# EAGLE design BLEduino_Test_Board (EAGLE 6.2)
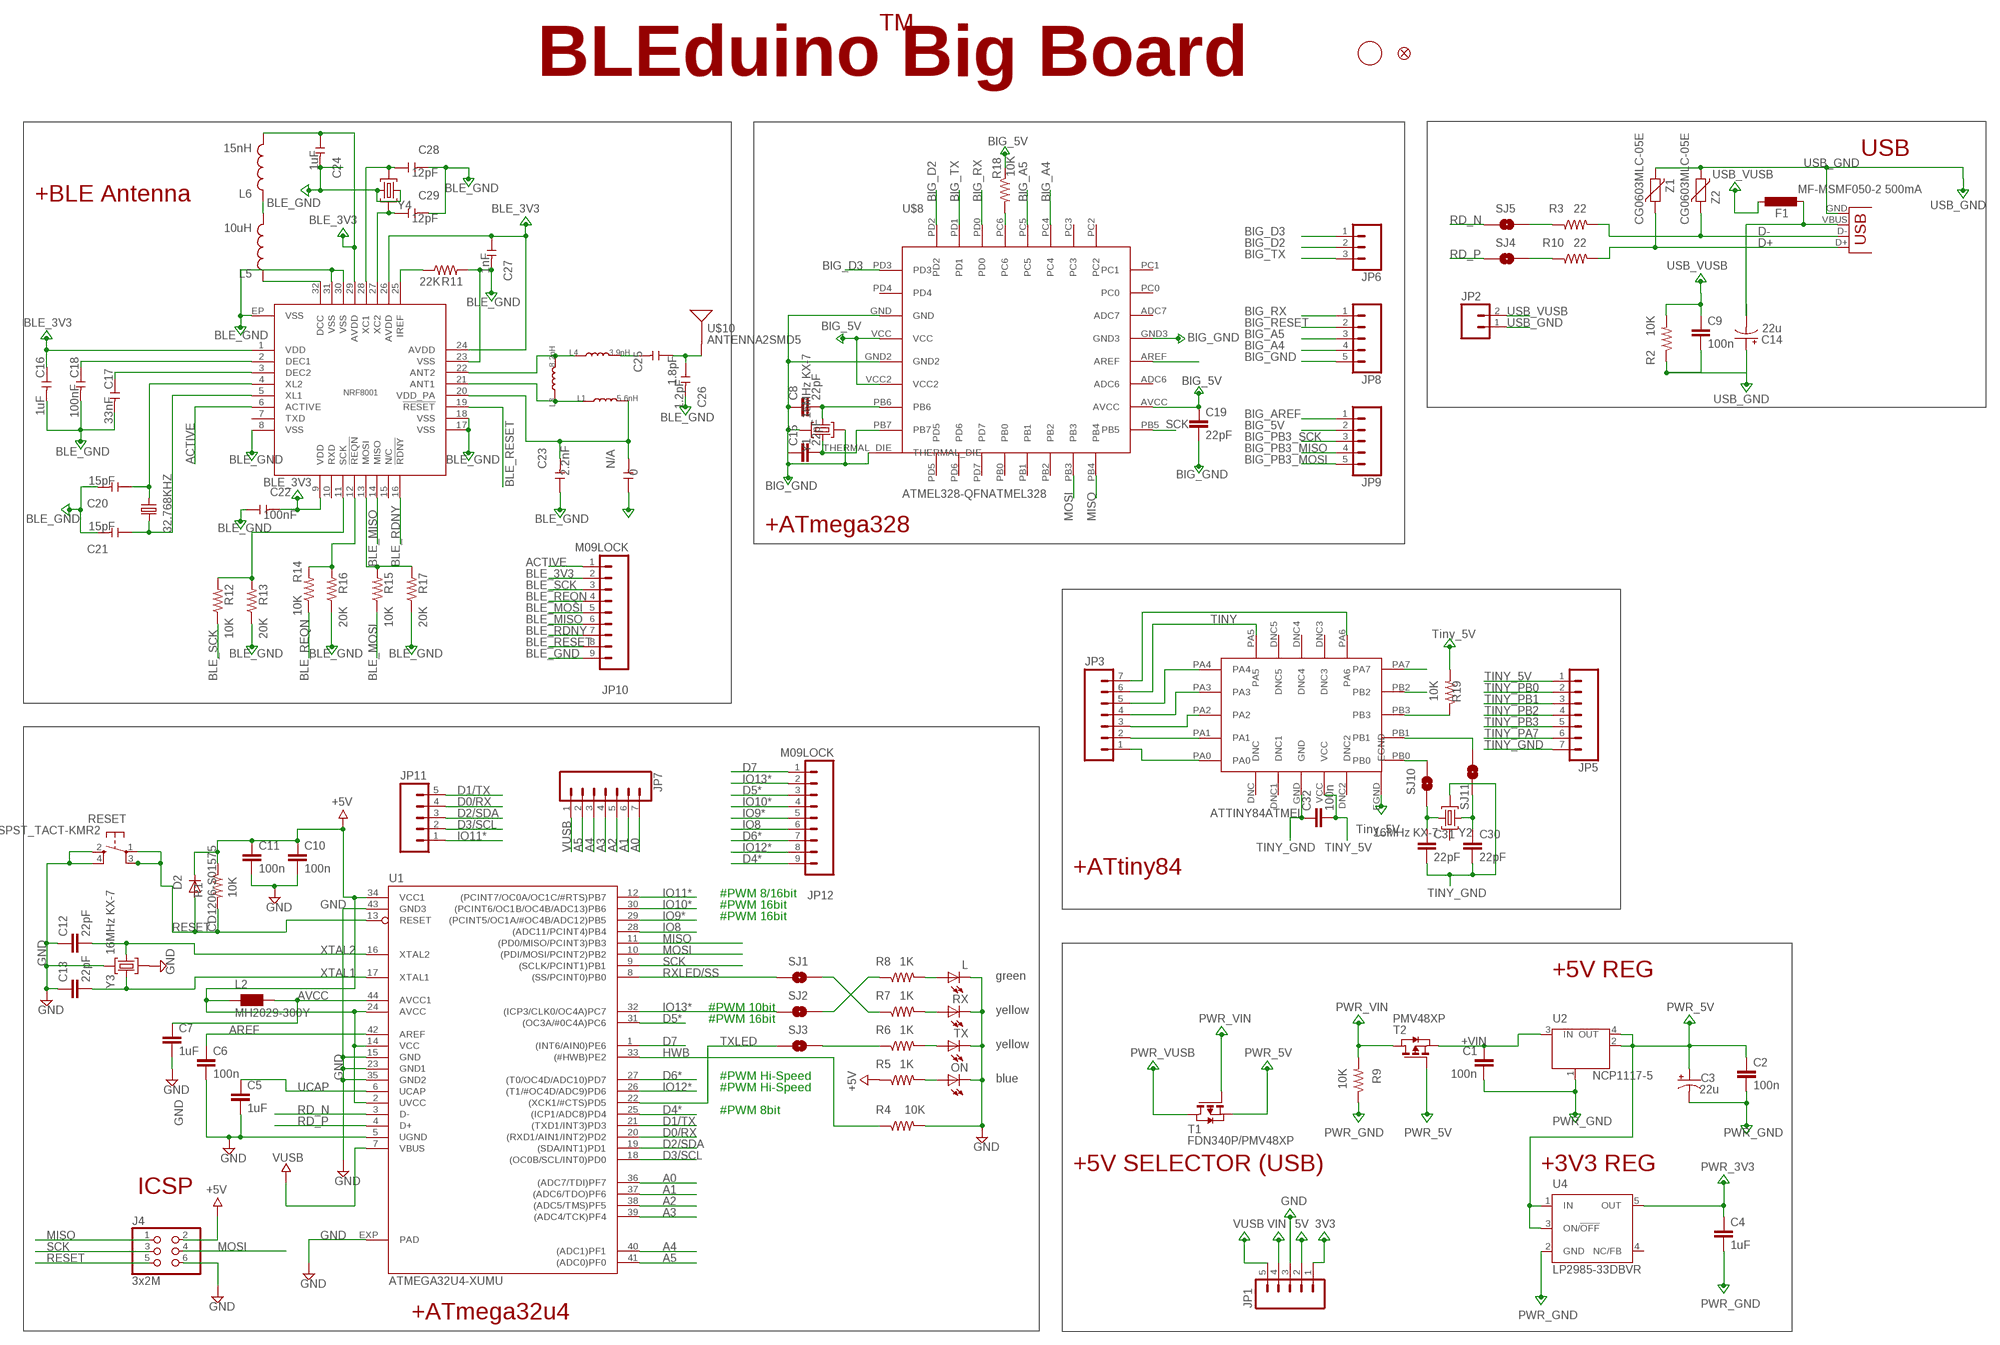
[diagram p0: schematic, sheet 1]

## Parts
32.768KHZ  FITNESSDEVICE_CRYSTAL-ABS10  [FITNESSDEVICE_CRYSTAL-ABS10]
C1  100n  CAP0603-CAP  [0603-CAP]
C2  100n  CAP0603-CAP  [0603-CAP]
C3  22u  CAP_POL1206  [EIA3216]
C4  1uF  CAP0603-CAP  [0603-CAP]
C5  1uF  CAP0603-CAP  [0603-CAP]
C6  100n  CAP0603-CAP  [0603-CAP]
C7  1uF  CAP0603-CAP  [0603-CAP]
C8  22pF  CAP0603-CAP  [0603-CAP]
C9  100n  CAP0603-CAP  [0603-CAP]
C10  100n  CAP0603-CAP  [0603-CAP]
C11  100n  CAP0603-CAP  [0603-CAP]
C12  22pF  CAP0603-CAP  [0603-CAP]
C13  22pF  CAP0603-CAP  [0603-CAP]
C14  22u  CAP_POL1206  [EIA3216]
C15  22pF  CAP0603-CAP  [0603-CAP]
C16  1uF  C-0603  [C0603]
C17  33nF  C-0402  [C0402]
C18  100nF  C-0402  [C0402]
C19  22pF  CAP0603-CAP  [0603-CAP]
C20  15pF  C-0402  [C0402]
C21  15pF  C-0402  [C0402]
C22  100nF  C-0402  [C0402]
C23  2.2nF  C-0402  [C0402]
C24  1uF  C-0603  [C0603]
C25  1.8pF  C-0402  [C0402]
C26  1.2pF  C-0402  [C0402]
C27  1nF  C-0402  [C0402]
C28  12pF  C-0402  [C0402]
C29  12pF  C-0402  [C0402]
C30  22pF  CAP0603-CAP  [0603-CAP]
C31  22pF  CAP0603-CAP  [0603-CAP]
C32  100n  CAP0603-CAP  [0603-CAP]
D2  CD1206-S01575  DIODE-MINIMELF  [MINIMELF]
F1  MF-MSMF050-2 500mA  L-EUL1812  [L1812]
J4  3x2M  PINHD-2X3  [2X03]
JP1  M05LOCK  [1X05_LOCK]
JP2  M02LOCK  [1X02_LOCK]
JP3  M07LOCK  [1X07_LOCK]
JP5  M07LOCK  [1X07_LOCK]
JP6  M03LOCK  [1X03_LOCK]
JP7  M07LOCK  [1X07_LOCK]
JP8  M05LOCK  [1X05_LOCK]
JP9  M05LOCK  [1X05_LOCK]
JP10  M09LOCK  [1X09_LOCK]
JP11  M05LOCK  [1X05_LOCK]
JP12  M09LOCK  [1X09_LOCK]
L  green  LEDCHIPLED_0805  [CHIPLED_0805]
L1  5.6nH  L'0402'  [L0402]
L2  MH2029-300Y  WE-CBF_0805  [0805]
L3  8.2nH  L'0402'  [L0402]
L4  3.9nH  L'0402'  [L0402]
L5  10uH  INDUCTOR0402  [C0402@1]
L6  15nH  INDUCTOR0402  [C0402@1]
N/A  0  C-0402  [C0402]
NRF8001  FITNESSDEVICE_NRF8001  [FITNESSDEVICE_QFN-32]
ON  blue  LEDCHIPLED_0805  [CHIPLED_0805]
R1  10K  RESISTOR0603-RES  [0603-RES]
R2  10K  RESISTOR0603-RES  [0603-RES]
R3  22  RESISTOR0603-RES  [0603-RES]
R4  10K  RESISTOR0603-RES  [0603-RES]
R5  1K  RESISTOR0603-RES  [0603-RES]
R6  1K  RESISTOR0603-RES  [0603-RES]
R7  1K  RESISTOR0603-RES  [0603-RES]
R8  1K  RESISTOR0603-RES  [0603-RES]
R9  10K  RESISTOR0603-RES  [0603-RES]
R10  22  RESISTOR0603-RES  [0603-RES]
R11  22K  RESISTOR0402-RES  [0402-RES]
R12  10K  RESISTOR0402-RES  [0402-RES]
R13  20K  RESISTOR0402-RES  [0402-RES]
R14  10K  RESISTOR0402-RES  [0402-RES]
R15  10K  RESISTOR0402-RES  [0402-RES]
R16  20K  RESISTOR0402-RES  [0402-RES]
R17  20K  RESISTOR0402-RES  [0402-RES]
R18  10K  RESISTOR0603-RES  [0603-RES]
R19  10K  RESISTOR0603-RES  [0603-RES]
RESET  SPST_TACT-KMR2  [KMR2]
RX  yellow  LEDCHIPLED_0805  [CHIPLED_0805]
SJ1  SOLDERJUMPERNO  [SJ_2S-NO]
SJ2  SOLDERJUMPERNO  [SJ_2S-NO]
SJ3  SOLDERJUMPERNO  [SJ_2S-NO]
SJ4  SOLDERJUMPERNO  [SJ_2S-NO]
SJ5  SOLDERJUMPERNO  [SJ_2S-NO]
SJ10  SOLDERJUMPERNO  [SJ_2S-NO]
SJ11  SOLDERJUMPERNO  [SJ_2S-NO]
T1  FDN340P/PMV48XP  PMOSSOT23  [SOT-23]
T2  PMV48XP  PMOSSOT23  [SOT-23]
TINY  ATTINY84ATMEL  [ATTINT84-QFN]
TX  yellow  LEDCHIPLED_0805  [CHIPLED_0805]
U1  ATMEGA32U4-XUMU  [QFN44ML7X7]
U2  NCP1117-5  LINEAR_MC33269ST  [LINEAR_SOT223]
U4  LP2985-33DBVR  LP2985-XXDBVR33  [SOT23-DBV]
U$8  ATMEL328-QFNATMEL328  [QFN]
U$10  ANTENNA2SMD5  [ANTENNA-CHIP5]
U$37  FIDUCIALMOUNT  [FIDUCIA-MOUNT]
U$53  FIDUCIAL1X2  [FIDUCIAL-1X2]
X1  USB-MICROB  [USB-MICROB]
Y1  16MHz KX-7  CRYSTAL-3.2-2.5  [CRYSTAL-3.2-2.5]
Y2  16MHz KX-7  CRYSTAL-3.2-2.5  [CRYSTAL-3.2-2.5]
Y3  16MHz KX-7  CRYSTAL-3.2-2.5  [CRYSTAL-3.2-2.5]
Y4  16MHz KX-7  CRYSTAL-3.2-2.5  [CRYSTAL-3.2-2.5]
Z1  CG0603MLC-05E  VARISTORCN0603  [CT/CN0603]
Z2  CG0603MLC-05E  VARISTORCN0603  [CT/CN0603]

## Nets
+5V: C10.1 C11.1 D2.C J4.2 L2.1 R1.1 R5.1 U1.2(UVCC) U1.14(VCC) U1.24(AVCC) U1.34(VCC1)
+VIN: C1.1 T2.2(S) U2.3(IN)
A0: JP7.7 U1.36((ADC7/TDI)PF7)
A1: JP7.6 U1.37((ADC6/TDO)PF6)
A2: JP7.5 U1.38((ADC5/TMS)PF5)
A3: JP7.4 U1.39((ADC4/TCK)PF4)
A4: JP7.3 U1.40((ADC1)PF1)
A5: JP7.2 U1.41((ADC0)PF0)
ACTIVE: JP10.1 NRF8001.6(ACTIVE)
AREF: C6.1 U1.42(AREF)
AVCC: C7.1 L2.2 U1.44(AVCC1)
BIG_5V: C19.1 JP9.2 R18.1 U$8.AVCC U$8.VCC U$8.VCC2
BIG_A4: JP8.4 U$8.PC4
BIG_A5: JP8.3 U$8.PC5
BIG_AREF: JP9.1 U$8.AREF
BIG_D2: JP6.2 U$8.PD2
BIG_D3: JP6.1 U$8.PD3
BIG_GND: C8.1 C15.1 C19.2 JP8.5 U$8.GND U$8.GND2 U$8.GND3 U$8.THERMAL_DIE Y1.2(GND) Y1.4(GND)
BIG_PB3_MISO: JP9.4 U$8.PB4
BIG_PB3_MOSI: JP9.5 U$8.PB3
BIG_PB3_SCK: JP9.3 U$8.PB5
BIG_RESET: JP8.2 R18.2 U$8.PC6
BIG_RX: JP8.1 U$8.PD0
BIG_TX: JP6.3 U$8.PD1
BLE_3V3: C16.1 C22.2 C24.1 C27.1 JP10.2 L6.2 NRF8001.1(VDD) NRF8001.9(VDD) NRF8001.24(AVDD) NRF8001.26(AVDD) NRF8001.29(AVDD)
BLE_GND: C16.2 C17.2 C18.2 C20.2 C21.2 C22.1 C23.1 C24.2 C26.2 C27.2 C28.2 C29.2 JP10.9 N/A.1 NRF8001.8(VSS) NRF8001.17(VSS) NRF8001.18(VSS) NRF8001.23(VSS) NRF8001.30(VSS) NRF8001.31(VSS) NRF8001.EP(VSS) R11.2 R13.1 R16.1 R17.1 Y4.1(C1) Y4.3(C2)
BLE_MISO: JP10.6 NRF8001.14(MISO)
BLE_MOSI: JP10.5 R15.1
BLE_MOSI_SHIFTED: NRF8001.13(MOSI) R15.2 R17.2
BLE_RDNY: JP10.7 NRF8001.16(!RDNY)
BLE_REQN: JP10.4 R14.1
BLE_REQN_SHIFTED: NRF8001.12(!REQN) R14.2 R16.2
BLE_RESET: JP10.8 NRF8001.19(!RESET)
BLE_SCK: JP10.3 R12.1
BLE_SCK_SHIFTED: NRF8001.11(SCK) R12.2 R13.2
D0/RX: JP11.4 U1.20((RXD1/AIN1/INT2)PD2)
D1/TX: JP11.5 U1.21((TXD1/INT3)PD3)
D2/SDA: JP11.3 U1.19((SDA/INT1)PD1)
D3/SCL: JP11.2 U1.18((OC0B/SCL/INT0)PD0)
D4*: JP12.9 U1.25((ICP1/ADC8)PD4)
D5*: JP12.3 U1.31((OC3A/#0C4A)PC6)
D6*: JP12.7 U1.27((T0/OC4D/ADC10)PD7)
D7: JP12.1 U1.1((INT6/AIN0)PE6)
D+: R10.2 X1.D+ Z1.1
D-: R3.2 X1.D- Z2.1
GND: C5.2 C6.2 C7.2 C10.2 C11.2 C12.1 C13.1 J4.6 L.C ON.C R4.2 RESET.2(S) RESET.4(S1) RX.C TX.C U1.5(UGND) U1.15(GND) U1.23(GND1) U1.35(GND2) U1.43(GND3) U1.EXP(PAD) Y3.2(GND) Y3.4(GND)
HWB: R4.1 U1.33((#HWB)PE2)
IO8: JP12.6 U1.28((ADC11/PCINT4)PB4)
IO9*: JP12.5 U1.29((PCINT5/OC1A/#OC4B/ADC12)PB5)
IO10*: JP12.4 U1.30((PCINT6/OC1B/OC4B/ADC13)PB6)
IO11*: JP11.1 U1.12((PCINT7/OC0A/OC1C/#RTS)PB7)
IO12*: JP12.8 U1.26((T1/#OC4D/ADC9)PD6)
IO13*: JP12.2 SJ2.1 U1.32((ICP3/CLK0/OC4A)PC7)
MISO: J4.1 U1.11((PD0/MISO/PCINT3)PB3)
MOSI: J4.4 U1.10((PDI/MOSI/PCINT2)PB2)
N$1: R7.1 SJ1.2
N$2: R7.2 RX.A
N$3: ON.A R5.2
N$4: R6.2 TX.A
N$5: R8.1 SJ2.2
N$6: R6.1 SJ3.2
N$7: L.A R8.2
N$8: R3.1 SJ5.2
N$9: R10.1 SJ4.2
N$10: C8.2 U$8.PB6 Y1.1(C1)
N$12: C15.2 U$8.PB7 Y1.3(C2)
N$13: C18.1 NRF8001.2(DEC1)
N$15: L5.1 NRF8001.32(DCC)
N$16: C30.1 SJ11.2 Y2.3(C2)
N$17: L5.2 L6.1
N$18: C17.1 NRF8001.3(DEC2)
N$19: 32.768KHZ.P$1 C20.1 NRF8001.4(XL2)
N$20: 32.768KHZ.P$2 C21.1 NRF8001.5(XL1)
N$23: C23.2 L1.2 N/A.2 NRF8001.20(VDD_PA)
N$24: L3.2 L4.1 NRF8001.22(ANT2)
N$25: L1.1 L3.1 NRF8001.21(ANT1)
N$26: C25.2 L4.2
N$27: C25.1 C26.1 U$10.FEED(SIGNAL)
N$28: NRF8001.25(IREF) R11.1
N$29: C28.1 NRF8001.28(XC1) Y4.4(GND)
N$30: C29.1 NRF8001.27(XC2) Y4.2(GND)
N$34: C31.1 SJ10.1 Y2.1(C1)
PWR_3V3: C4.1 JP1.1 U4.5(OUT)
PWR_5V: C2.1 C3.A(+) JP1.2 T1.2(S) T2.3(G) U2.2(OUT) U2.4(OUT) U4.1(IN) U4.3(ON/!OFF)
PWR_GND: C1.2 C2.2 C3.C(-) C4.2 JP1.3 R9.1 U2.1(GND/ADJ) U4.2(GND)
PWR_VIN: JP1.4 R9.2 T1.3(G) T2.1(D)
PWR_VUSB: JP1.5 T1.1(D)
RD_N: SJ5.1 U1.3(D-)
RD_P: SJ4.1 U1.4(D+)
RESET: D2.A J4.5 R1.2 RESET.1(P) RESET.3(P1) U1.13(RESET)
RXLED/SS: SJ1.1 U1.8((SS/PCINT0)PB0)
SCK: J4.3 U1.9((SCLK/PCINT1)PB1)
TINY_5V: C32.2 JP5.1 R19.2 TINY.VCC
TINY_GND: C30.2 C31.2 C32.1 JP5.7 TINY.EGND TINY.GND Y2.4(GND)
TINY_PA0: JP3.1 TINY.PA0
TINY_PA1: JP3.2 TINY.PA1
TINY_PA2: JP3.3 TINY.PA2
TINY_PA3: JP3.4 TINY.PA3
TINY_PA4: JP3.5 TINY.PA4
TINY_PA5: JP3.6 TINY.PA5
TINY_PA6: JP3.7 TINY.PA6
TINY_PA7: JP5.6 TINY.PA7
TINY_PB0: JP5.2 SJ10.2 TINY.PB0
TINY_PB1: JP5.3 SJ11.1 TINY.PB1
TINY_PB2: JP5.4 TINY.PB2
TINY_PB3: JP5.5 R19.1 TINY.PB3
TXLED: SJ3.1 U1.22((XCK1/#CTS)PD5)
UCAP: C5.1 U1.6(UCAP)
USB_GND: C9.2 C14.A(+) JP2.1 R2.1 X1.GND Z1.2 Z2.2
USB_VUSB: C9.1 F1.2 JP2.2 R2.2
VUSB: JP7.1 U1.7(VBUS)
VUSBD: C14.C(-) F1.1 X1.VBUS
XTAL1: C13.2 U1.17(XTAL1) Y3.3(C2)
XTAL2: C12.2 U1.16(XTAL2) Y3.1(C1)
Unconnected: NRF8001.7(TXD) NRF8001.10(RXD) NRF8001.15(N/C) TINY.DNC TINY.DNC1 TINY.DNC2 TINY.DNC3 TINY.DNC4 TINY.DNC5 U4.4(NC/FB) U$8.ADC6 U$8.ADC7 U$8.PB0 U$8.PB1 U$8.PB2 U$8.PC0 U$8.PC1 U$8.PC2 U$8.PC3 U$8.PD4 U$8.PD5 U$8.PD6 U$8.PD7 Y2.2(GND)

## Notes on the sheet
- TM
- BLEduino Big Board
- BIG_5V
- USB
- +BLE Antenna
- BIG_5V
- BIG_GND
- BIG_5V
- SCK
- BIG_GND
- BIG_GND
- MOSI | MISO
- +ATmega328
- Tiny_5V
- Tiny_5V
- +ATtiny84
- #PWM 8/16bit
- #PWM 16bit
- #PWM 16bit
- +5V REG
- #PWM 10bit
- #PWM 16bit
- #PWM Hi-Speed
- #PWM Hi-Speed
- #PWM 8bit
- +5V SELECTOR (USB) | +3V3 REG
- ICSP
- GND
- VUSB | VIN | 5V | 3V3
- +ATmega32u4

## Library data of the parts
32.768KHZ = bluetooth:FITNESSDEVICE_CRYSTAL-ABS10: ABS10-32.768KHZ-9-T
C1 C2 C4-C13 C15 C19 C30-C32 = SparkFun:CAP: Capacitor Standard 0603 ceramic capacitor, and 0.1" leaded capacitor.
C3 C14 = SparkFun:CAP_POL: Capacitor Polarized These are standard SMD and PTH capacitors. Normally 10uF, 47uF, and 100uF in electrolytic and tantalum varieties. Always verify the external diameter of the through hole cap, it varies with capacity, voltage, and manufacturer. The EIA devices should be standard.
C16-C18 C20-C29 N/A = Discrete:C*: Ceramic Capacitors
D2 = diode:DIODE-: DIODE
F1 = rcl:L-EU: INDUCTOR, European symbol
J4 = SmartPrj:PINHD-2X3: PIN HEADER
JP1 JP8 JP9 JP11 = SparkFun:M05: Header 5 Standard 5-pin 0.1" header. Use with straight break away headers (SKU : PRT-00116), right angle break away headers (PRT-00553), swiss pins (PRT-00743), machine pins (PRT-00117), and female headers (PRT-00115). Molex polarized connector foot print use with SKU : PRT-08230 with associated crimp pins and housings.
JP2 = SparkFun:M02: Header 2 Standard 2-pin 0.1" header. Use with straight break away headers (SKU : PRT-00116), right angle break away headers (PRT-00553), swiss pins (PRT-00743), machine pins (PRT-00117), and female headers (PRT-00115). Molex polarized connector foot print use with SKU : PRT-08233 with associated crimp pins and housings.
JP3 JP5 JP7 = SparkFun:M07: Header 7 Standard 7-pin 0.1" header. Use with straight break away headers (SKU : PRT-00116), right angle break away headers (PRT-00553), swiss pins (PRT-00743), machine pins (PRT-00117), and female headers (PRT-00115). NOTES ON THE VARIANTS LOCK and LOCK_LONGPADS... This footprint was designed to help hold the alignment of a through-hole component (i.e. 7-pin header) while soldering it into place. You may notice that each hole has been shifted either up or down by 0.005 of an inch from it's more standard position (which is usually a perfectly straight line). This slight alteration caused the pins (the squares in the middle) to touch the edges of the holes. Because they are alternating, it causes a "brace" to hold the header in place. 0.005 has proven to be the perfect amount of "off-center" position when using our standard breakaway headers. Although looks a little odd when you look at the bare footprint, once you have a header in there, the alteration is very hard to notice. Also, if you push a header all the way into place, it is covered up entirely on the bottom side. This idea of altering the position of holes to aid alignment will be further integrated into the Sparkfun Library for other footprints. It can help hold any component with 3 or more connection pins.
JP6 = SparkFun:M03: Header 3 Standard 3-pin 0.1" header. Use with straight break away headers (SKU : PRT-00116), right angle break away headers (PRT-00553), swiss pins (PRT-00743), machine pins (PRT-00117), and female headers (PRT-00115). Molex polarized connector foot print use with SKU : PRT-08232 with associated crimp pins and housings.
JP10 JP12 = SparkFun:M09: Header 9 Standard 9-pin 0.1" header. Use with straight break away headers (SKU : PRT-00116), right angle break away headers (PRT-00553), swiss pins (PRT-00743), machine pins (PRT-00117), and female headers (PRT-00115).
L ON RX TX = led:LED: LED OSRAM: - CHIPLED LG R971, LG N971, LY N971, LG Q971, LY Q971, LO R971, LY R971 LH N974, LH R974 LS Q976, LO Q976, LY Q976 LO Q996 - Hyper CHIPLED LW Q18S LB Q993, LB Q99A, LB R99A - SideLED LS A670, LO A670, LY A670, LG A670, LP A670 LB A673, LV A673, LT A673, LW A673 LH A674 LY A675 LS A676, LA A676, LO A676, LY A676, LW A676 LS A679, LY A679, LG A679 - Hyper Micro SIDELED® LS Y876, LA Y876, LO Y876, LY Y876 LT Y87S - SmartLED LW L88C, LW L88S LB L89C, LB L89S, LG L890 LS L89K, LO L89K, LY L89K LS L896, LA L896, LO L896, LY L896 - TOPLED LS T670, LO T670, LY T670, LG T670, LP T670 LSG T670, LSP T670, LSY T670, LOP T670, LYG T670 LG T671, LOG T671, LSG T671 LB T673, LV T673, LT T673, LW T673 LH T674 LS T676, LA T676, LO T676, LY T676, LB T676, LH T676, LSB T676, LW T676 LB T67C, LV T67C, LT T67C, LS T67K, LO T67K, LY T67K, LW E67C LS E67B, LA E67B, LO E67B, LY E67B, LB E67C, LV E67C, LT E67C LW T67C LS T679, LY T679, LG T679 LS T770, LO T770, LY T770, LG T770, LP T770 LB T773, LV T773, LT T773, LW T773 LH T774 LS E675, LA E675, LY E675, LS T675 LS T776, LA T776, LO T776, LY T776, LB T776 LHGB T686 LT T68C, LB T68C - Hyper Mini TOPLED® LB M676 - Mini TOPLED Santana® LG M470 LS M47K, LO M47K, LY M47K Source: http://www.osram.convergy.de LUXEON: - LUMILED® LXK2-PW12-R00, LXK2-PW12-S00, LXK2-PW14-U00, LXK2-PW14-V00 LXK2-PM12-R00, LXK2-PM12-S00, LXK2-PM14-U00 LXK2-PE12-Q00, LXK2-PE12-R00, LXK2-PE12-S00, LXK2-PE14-T00, LXK2-PE14-U00 LXK2-PB12-K00, LXK2-PB12-L00, LXK2-PB12-M00, LXK2-PB14-N00, LXK2-PB14-P00, LXK2-PB14-Q00 LXK2-PR12-L00, LXK2-PR12-M00, LXK2-PR14-Q00, LXK2-PR14-R00 LXK2-PD12-Q00, LXK2-PD12-R00, LXK2-PD12-S00 LXK2-PH12-R00, LXK2-PH12-S00 LXK2-PL12-P00, LXK2-PL12-Q00, LXK2-PL12-R00 Source: www.luxeon.com KINGBRIGHT: KA-3528ASYC Source: www.kingbright.com
L1 L3 L4 = Discrete:L*
L2 = wuerth-elektronik:WE-CBF: SMD EMI Suppression Ferrite Beads - excellent anti-EMI properties - low DCR - impedances till 3000 ohms - rated current up to 6 A
L5 L6 = SparkFun:INDUCTOR: Inductors Basic Inductor/Choke - 0603 and 1206. Footprints are not proven and vary greatly between part numbers.
NRF8001 = bluetooth:FITNESSDEVICE_NRF8001: nRF8001 is a Bluetooth® low energy solution designed for operation in the peripheral role. By integrating a Bluetooth low energy compliant radio (PHY), slave mode link controller and host, nRF8001 offers you an easy way to add Bluetooth low energy connectivity to your application.
R1-R19 = SparkFun:RESISTOR: Resistor Basic schematic elements and footprints for 0603, 1206, and PTH resistors.
RESET = adafruit:SPST_TACT: SMT 6mm switch, EVQQ2 series http://www.ladyada.net/library/eagle
SJ1-SJ5 SJ10 SJ11 = SparkFun:SOLDERJUMPER: Solder Jumper Standard SMD solder jumper. Used to automate production. Two varients : Normally Open and Normally Closed are the same, but have different paste layers. NC will have a large amount of paste and should jumper during reflow.
T1 T2 = zetex:PMOSSOT23: MOS FET
TINY = Mark-ATTINY84:ATTINY84
U1 = SmartPrj:ATMEGA32U4-XU
U2 = SmartPrj:LINEAR_MC33269ST*: Adjustable Output Low Dropout Voltage Regulator 800 mA Source: http://www.onsemi.com/pub/Collateral/MC33269-D.PDF
U4 = SmartPrj:LP2985-XXDBVR: ULTRALOW-POWER 50-mA LOW-DROPOUT LINEAR REGULATORS 50-mA Low-Dropout Regulator Source: http://focus.ti.com/lit/ds/symlink/tps77001.pdf
U$8 = Mark-ATmega328-qft:ATMEL328-QFN
U$10 = SparkFun:ANTENNA2: Antenna Single endded antenna. Common with smaller chip antennas. CHIP4 package is the GPS Chip Antenna SKU: GPS-08418. CHIP5 package is 2.4GHz chip antenna SKU: WRL-00144.
U$37 = SmartPrj:FIDUCIALMOUNT
U$53 = SparkFun:FIDUCIAL: Fiducial Alignment Points Various fiducial points for machine vision alignment.
X1 = SparkFun:USB: USB Connectors USB-B-PTH is fully proven SKU : PRT-00139 USB-miniB is fully proven SKU : PRT-00587 USB-A-PCB is untested. USB-A-H is throughly reviewed, but untested. Spark Fun Electronics SKU : PRT-00437 USB-B-SMT is throughly reviewed, but untested. Needs silkscreen touching up. USB-A-S has not been used/tested USB-MB-H has not been used/tested
Y1-Y4 = SmartPrj:CRYSTAL-3.2-2.5
Z1 Z2 = varistor:VARISTOR: VARISTOR

## Net classes
0 default: width 0.203 mm

## Board
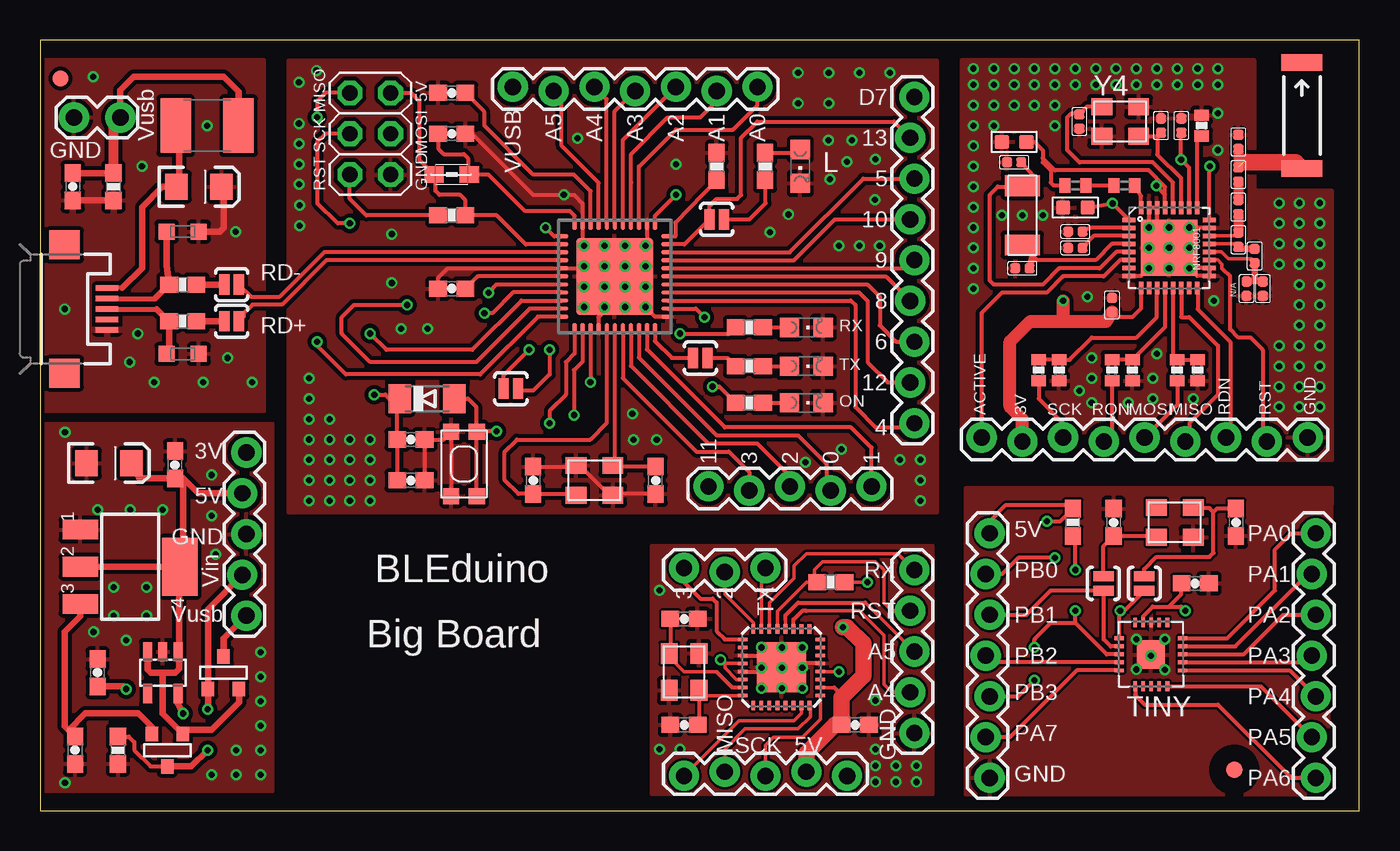
[diagram p1: board, top side]
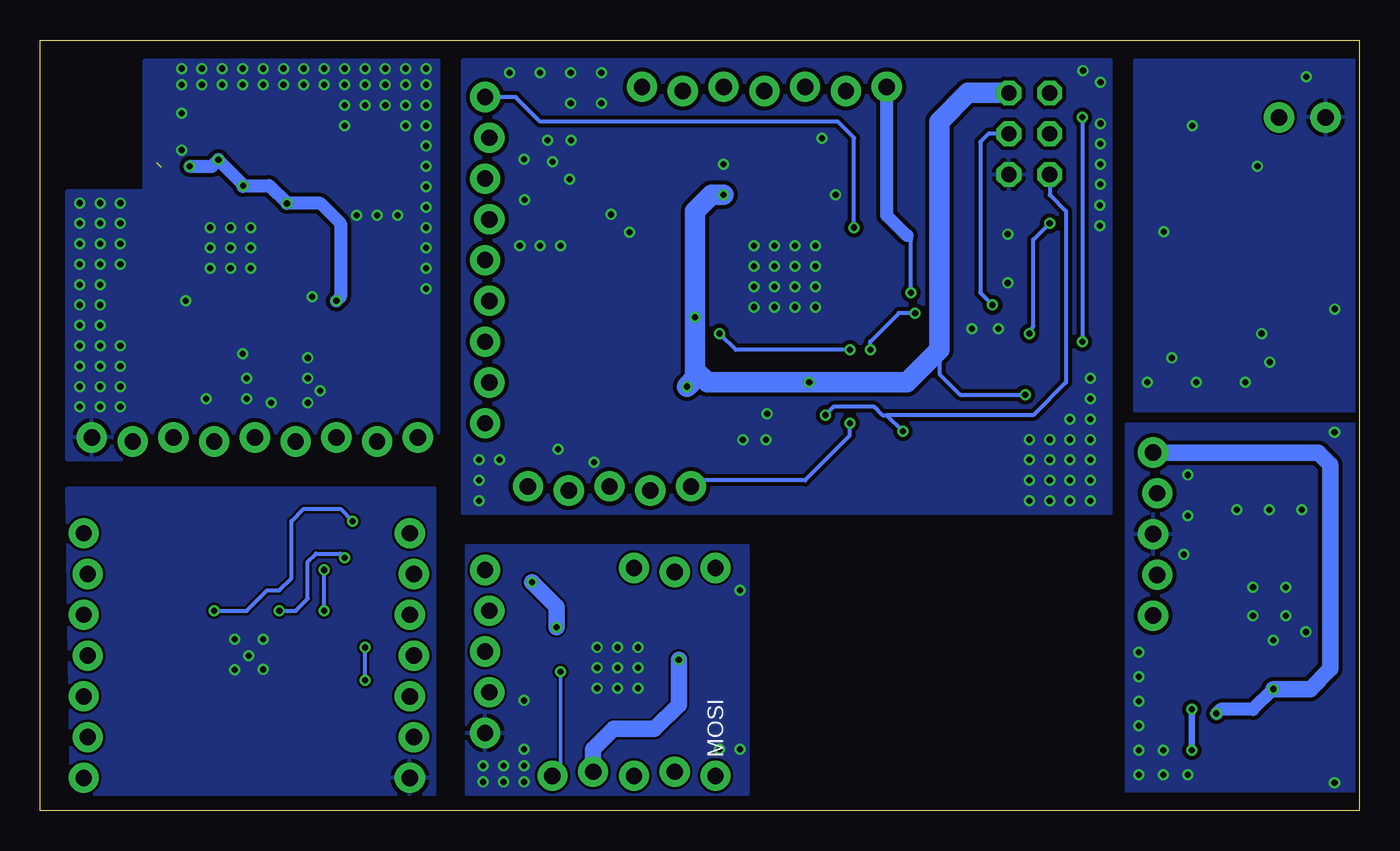
[diagram p2: board, bottom side, seen from below]

Size 82.22 x 48 mm. Coordinates in mm from the lower left corner, seen from the top.
Outline: 0,0 82.22,0 82.22,48 0,48 0,0
Copper layers (1*2*15*16): Top 0.035mm / dielectric 0.2mm / layer 2 0.0175mm / dielectric 1.1mm / layer 15 0.0175mm / dielectric 0.2mm / Bottom 0.035mm
Design rules: minimum track width 6mil, minimum drill 12mil, track to track 6mil, track to pad 6mil, pad to pad 6mil, via to via 6mil, smd to smd 0mil, copper to edge 10mil, drill to drill 10mil, minimum pad ring 6mil, minimum via ring 6mil, stop-mask expansion 2mil, vias tented up to drill 25mil, thermal gap 10mil

### Footprints (pad centres in the part's own frame; a part is rotated, then mirrored left to right if it is on the bottom)
FITNESSDEVICE_CRYSTAL-ABS10 = smd 1.3 x 2.2: P$1 -1.85,0; P$2 1.85,0
0603-CAP = smd 1.1 x 1: 1 -0.85,0; 2 0.85,0
EIA3216 = smd 1.4 x 1.6: A 1.4,0; C -1.4,0
C0603 = smd 0.889 x 0.889: 1 -0.762,0; 2 0.762,0
C0402 = smd 0.635 x 0.635: 1 -0.445,0; 2 0.445,0
MINIMELF = smd 1.4 x 1.8: A 1.7,0; C -1.7,0
L1812 = smd 1.9 x 3.4: 1 -1.95,0; 2 1.95,0
2X03 = drill 0.95 pad 1.55 octagon: 1 -2.54,-1.27; 2 -2.54,1.27; 3 0,-1.27; 4 0,1.27; 5 2.54,-1.27; 6 2.54,1.27
1X05_LOCK = drill 1.016 pad 1.88: 1 0,0.127; 2 2.54,-0.127; 3 5.08,0.127; 4 7.62,-0.127; 5 10.16,0.127
1X02_LOCK = drill 1.016 pad 1.88: 1 -0.178,0; 2 2.718,0
1X07_LOCK = drill 1.016 pad 1.88: 1 0,0.127; 2 2.54,-0.127; 3 5.08,0.127; 4 7.62,-0.127; 5 10.16,0.127; 6 12.7,-0.127; 7 15.24,0.127
1X03_LOCK = drill 1.016 pad 1.88: 1 0,0.127; 2 2.54,-0.127; 3 5.08,0.127
1X09_LOCK = drill 1.016 pad 1.88: 1 0,0.127; 2 2.54,-0.127; 3 5.08,0.127; 4 7.62,-0.127; 5 10.16,0.127; 6 12.7,-0.127; 7 15.24,0.127; 8 17.78,-0.127; 9 20.32,0.127
CHIPLED_0805 = smd 1.2 x 1.2: A 0,-1.05; C 0,1.05
L0402 = smd 0.635 x 0.635: 1 -0.445,0; 2 0.445,0
0805 = smd 1.2 x 1: 1 -1.1,0; 2 1.1,0
C0402' = smd 0.7 x 0.9: 1 -0.65,0; 2 0.65,0
FITNESSDEVICE_QFN-32 = smd 0.285 x 0.8: 1 -1.75,-2.5; 2 -1.25,-2.5; 3 -0.75,-2.5; 4 -0.25,-2.5; 5 0.25,-2.5; 6 0.75,-2.5; 7 1.25,-2.5; 8 1.75,-2.5; 17 1.75,2.5; 18 1.25,2.5; 19 0.75,2.5; 20 0.25,2.5; 21 -0.25,2.5; 22 -0.75,2.5; 23 -1.25,2.5; 24 -1.75,2.5 | smd 0.8 x 0.285: 9 2.5,-1.75; 10 2.5,-1.25; 11 2.5,-0.75; 12 2.5,-0.25; 13 2.5,0.25; 14 2.5,0.75; 15 2.5,1.25; 16 2.5,1.75; 25 -2.5,1.75; 26 -2.5,1.25; 27 -2.5,0.75; 28 -2.5,0.25; 29 -2.5,-0.25; 30 -2.5,-0.75; 31 -2.5,-1.25; 32 -2.5,-1.75 | smd 3.5 x 3.5: EP 0,0
0603-RES = smd 1.1 x 1: 1 -0.85,0; 2 0.85,0
0402-RES = smd 0.7 x 0.9: 1 -0.65,0; 2 0.65,0
KMR2 = smd 1 x 1: 1 2,0.8; 2 2,-0.8; 3 -2,0.8; 4 -2,-0.8
SJ_2S-NO = smd 0.635 x 1.27: 1 -0.45,0; 2 0.45,0
SOT-23 = smd 0.787 x 0.889: 1 0.025,-1.016; 2 -0.94,1.016; 3 0.991,1.016
ATTINT84-QFN = smd 0.23 x 0.6: DNC -1.03,-2.06; DNC1 -0.53,-2.06; DNC2 0.97,-2.06; DNC3 0.47,1.91; DNC4 -0.03,1.91; DNC5 -0.53,1.91; GND -0.03,-2.06; PA5 -1.03,1.91; PA6 0.97,1.91; VCC 0.47,-2.06 | smd 1.78 x 1.78: EGND -0.01,-0.06 | smd 0.6 x 0.23: PA0 -1.99,-1.08; PA1 -1.99,-0.58; PA2 -1.99,-0.08; PA3 -1.99,0.42; PA4 -1.99,0.92; PA7 1.96,0.92; PB0 1.96,-1.08; PB1 1.96,-0.58; PB2 1.96,0.42; PB3 1.96,-0.08
QFN44ML7X7 = smd 0.75 x 0.275: 1 -3.275,2.5; 2 -3.275,2; 3 -3.275,1.5; 4 -3.275,1; 5 -3.275,0.5; 6 -3.275,0; 7 -3.275,-0.5; 8 -3.275,-1; 9 -3.275,-1.5; 10 -3.275,-2; 11 -3.275,-2.5; 23 3.275,-2.5; 24 3.275,-2; 25 3.275,-1.5; 26 3.275,-1; 27 3.275,-0.5; 28 3.275,0; 29 3.275,0.5; 30 3.275,1; 31 3.275,1.5; 32 3.275,2; 33 3.275,2.5 | smd 0.275 x 0.75: 12 -2.5,-3.275; 13 -2,-3.275; 14 -1.5,-3.275; 15 -1,-3.275; 16 -0.5,-3.275; 17 0,-3.275; 18 0.5,-3.275; 19 1,-3.275; 20 1.5,-3.275; 21 2,-3.275; 22 2.5,-3.275; 34 2.5,3.275; 35 2,3.275; 36 1.5,3.275; 37 1,3.275; 38 0.5,3.275; 39 0,3.275; 40 -0.5,3.275; 41 -1,3.275; 42 -1.5,3.275; 43 -2,3.275; 44 -2.5,3.275 | smd 4.826 x 4.826: EXP 0,0
LINEAR_SOT223 = smd 1.219 x 2.235: 1 -2.311,-3.099; 2 0,-3.099; 3 2.311,-3.099 | smd 3.6 x 2.2: 4 0,3.099
SOT23-DBV = smd 0.55 x 1.2: 1 -0.95,-1.3; 2 0,-1.3; 3 0.95,-1.3; 4 0.95,1.3; 5 -0.95,1.3
QFN = smd 0.6 x 0.23: ADC6 2.4,-0.73; ADC7 2.4,0.77; AREF 2.4,-0.23; AVCC 2.4,-1.23; GND -2.45,0.77; GND2 -2.45,-0.23; GND3 2.4,0.27; PB5 2.4,-1.73; PB6 -2.45,-1.23; PB7 -2.45,-1.73; PC0 2.4,1.27; PC1 2.4,1.77; PD3 -2.45,1.77; PD4 -2.45,1.27; VCC -2.45,0.27; VCC2 -2.45,-0.73 | smd 0.23 x 0.6: PB0 -0.28,-2.34; PB1 0.22,-2.34; PB2 0.72,-2.34; PB3 1.22,-2.34; PB4 1.72,-2.34; PC2 1.72,2.43; PC3 1.22,2.43; PC4 0.72,2.43; PC5 0.22,2.43; PC6 -0.28,2.43; PD0 -0.78,2.43; PD1 -1.28,2.43; PD2 -1.78,2.43; PD5 -1.78,-2.34; PD6 -1.28,-2.34; PD7 -0.78,-2.34 | smd 3.1 x 3.1: THERMAL_DIE -0.03,0.04
ANTENNA-CHIP5 = smd 1.016 x 2.54: FEED -3.302,0; NC 3.302,0
FIDUCIA-MOUNT = smd 1.016 x 1.016: P$1 0,0
FIDUCIAL-1X2 = smd 1 x 1: 1 0,0
USB-MICROB = smd 0.35 x 1.4: D+ 0,2.65; D- -0.65,2.65; GND 1.3,2.65; ID 0.65,2.65; VBUS -1.3,2.65 | smd 1.8 x 1.9: MT1 -4,0; MT2 4,0
CRYSTAL-3.2-2.5 = smd 1.3 x 1.05: 1 -1.15,-0.925; 2 1.15,-0.925; 3 1.15,0.925; 4 -1.15,0.925
CT/CN0603 = smd 1 x 1: 1 -1,0; 2 1,0

### Placement (x,y rotation side)
32.768KHZ  61.21,37.08 90 top
C1  2.18,3.76 270 top
C2  8.41,21.54 90 top
C3  4.29,21.64 0 top
C4  3.58,8.59 90 top
C5  25.65,32.51 180 top
C6  25.65,44.7 180 top
C7  25.65,42.16 0 top
C8  40.13,11.94 180 top
C9  2.03,38.86 270 top
C10  23.11,20.57 0 top
C11  23.11,23.11 0 top
C12  30.73,20.57 270 top
C13  38.35,20.57 90 top
C14  9.91,38.86 0 top
C15  40.13,5.33 0 top
C16  64.52,37.57 180 top
C17  64.52,35.05 180 top
C18  64.52,36.07 180 top
C19  50.8,5.33 0 top
C20  61.21,33.78 180 top
C21  60.71,40.39 180 top
C22  66.8,31.5 270 top
C23  75.18,32.51 90 top
C24  60.71,41.66 180 top
C25  74.68,39.62 270 top
C26  74.68,41.66 90 top
C27  71.12,42.67 90 top
C28  64.77,42.93 270 top
C29  69.85,42.67 90 top
C30  66.9,17.96 90 top
C31  74.52,17.96 270 top
C32  71.98,14.15 180 top
D2  24.13,25.65 0 top
F1  10.41,42.67 0 top
J4  20.57,42.16 270 top
JP1  12.73,22.3 270 top
JP2  2.29,43.18 0 top
JP3  79.38,17.27 270 top
JP5  59.05,17.27 270 top
JP6  40.13,14.99 0 top
JP7  29.46,44.96 0 top
JP8  54.36,14.99 270 top
JP9  50.29,2.29 180 top
JP10  58.67,23.11 0 top
JP11  41.66,20.07 0 top
JP12  54.36,44.45 270 top
L  47.37,40.13 180 top
L1  75.69,34.54 270 top
L2  25.65,39.62 0 top
L3  74.68,35.56 90 top
L4  74.68,37.59 90 top
L5  10uH  [C0402']  67.56,38.94 180 top
L6  15nH  [C0402']  64.52,38.94 180 top
N/A  76.2,32.51 90 top
NRF8001  70.36,35.05 270 top
ON  47.75,25.4 270 top
R1  25.65,37.08 180 top
R2  4.57,38.86 90 top
R3  8.89,32.77 180 top
R4  42.16,40.13 90 top
R5  44.2,25.4 0 top
R6  44.2,27.69 0 top
R7  44.2,30.1 0 top
R8  45.19,40.13 90 top
R9  4.85,3.76 90 top
R10  8.89,30.48 180 top
R11  72.39,42.67 90 top
R12  62.23,27.43 90 top
R13  63.5,27.43 90 top
R14  66.8,27.43 90 top
R15  70.87,27.43 90 top
R16  68.07,27.43 90 top
R17  72.14,27.43 90 top
R18  49.28,14.22 180 top
R19  64.36,17.96 90 top
RESET  26.42,21.59 270 top
RX  47.75,30.1 270 top
SJ1  29.34,26.29 0 top
SJ2  42.16,36.83 0 top
SJ3  41.15,28.19 0 top
SJ4  11.94,30.48 180 top
SJ5  11.94,32.77 180 top
SJ10  68.81,14.15 270 top
SJ11  66.27,14.15 90 top
T1  11.46,8.59 180 top
T2  7.9,3.76 0 top
TINY  69.22,9.65 180 top
TX  47.75,27.69 270 top
U1  35.81,33.27 0 top
U2  5.61,15.19 270 top
U4  7.65,8.59 180 top
U$8  46.23,8.89 0 top
U$10  78.64,43.31 90 top
U$37  74.42,2.54 0 top
U$53  1.27,45.59 0 top
X1  1.52,31.24 270 top
Y1  40.13,8.64 270 top
Y2  70.71,17.96 180 top
Y3  34.54,20.57 0 top
Y4  67.31,42.93 0 top
Z1  8.89,28.45 0 top
Z2  8.89,36.07 0 top

### Tracks (layer width: path | path; a pad name or v marks a point on that pad's centre or on a via)
+5V  (via drill 0.38)
  Top 0.254: U1.14 34.31,26.69 v34.29,26.67 | U1.2 30.26,35.27 28.45,37.08 R1.1 26.5,38.01 26.16,38.35 24.89,38.35 24.64,38.61 24.64,39.54 L2.1 | L2.1 24.55,39.45 | C10.1 C11.1 22.26,25.15 | 22.26,25.15 22.26,25.49 D2.C | J4.2 23.11,44.7 23.62,44.2 23.62,40.56 L2.1 | U1.24 40.86,31.27 v41.4,30.73 | v41.91,26.42 42.33,26.42 R5.1 | U1.34 38.31,37.04 v39.62,38.35 | v20.83,25.91 21.5,25.91 22.26,25.15
  Bottom 0.254: 26.16,28.7 26.16,27.18 24.89,25.91 v20.83,25.91
  Bottom 1.27: 41.4,27.43 v41.4,30.73 41.4,37.34 40.39,38.35 v39.62,38.35 | 41.4,27.43 41.4,26.92 v41.91,26.42 | 41.4,27.43 40.64,26.67 v34.29,26.67 28.19,26.67 26.16,28.7 26.16,42.93 24.38,44.7 J4.2
+VIN
  Top 0.406: U2.3 2.52,12.09 1.55,11.12 1.55,5.24 1.78,5.01 | 2.48,4.61 C1.1 1.78,5.01 | T2.2 6.96,5.21 6.12,6.04 2.82,6.04 1.78,5.01
A0
  Top 0.254: U1.36 37.31,40.11 39.62,42.42 43.18,42.42 44.7,43.94 JP7.7
A1
  Top 0.254: U1.37 36.81,39.1 36.83,39.12 36.83,40.89 39.12,43.18 41.15,43.18 42.16,44.2 JP7.6
A2
  Top 0.254: U1.38 36.31,39.62 36.32,39.62 36.32,41.78 JP7.5
A3
  Top 0.254: U1.39 35.81,43.56 JP7.4
A4
  Top 0.254: U1.40 35.31,44.31 JP7.3
A5
  Top 0.254: U1.41 34.81,39.1 32.51,41.4 32.51,44.32 JP7.2
ACTIVE
  Top 0.254: NRF8001.6 67.32,34.3 66.29,33.27 63.75,33.27 62.74,32.26 59.94,32.26 58.67,30.99 JP10.1
AREF
  Top 0.254: U1.42 34.31,38.58 33.27,39.62 30.73,39.62 27.69,42.67 27.69,43.52 C6.1
AVCC
  Top 0.254: U1.44 33.31,37.04 33.02,37.34 30.23,37.34 27.94,39.62 L2.2 26.67,39.71 26.67,40.64 26.42,40.89 25.15,40.89 24.8,41.24 C7.1
BIG_5V  (via drill 0.38)
  Top 0.203: U$8.VCC2 43.4,8.16 42.67,8.89 42.67,9.14 v42.42,9.4 42.66,9.16 U$8.VCC
  Top 0.229: U$8.AVCC 49.49,7.66 | 50.04,5.42 C19.1 49.53,5.33 | v51.56,14.22 R18.1
  Top 0.254: 49.49,7.66 50.04,7.11
  Top 1.016: 49.53,5.33 47.75,3.56 JP9.2 | v50.04,11.43 50.29,11.43 51.31,10.41 51.31,8.38 50.04,7.11 49.95,7.02 C19.1
  Bottom 1.016: v51.56,14.22 50.04,12.7 v50.04,11.43 | 47.75,2.29 JP9.2 47.75,3.81 46.48,5.08 43.94,5.08 42.42,6.6 v42.42,9.4
BIG_A4
  Top 0.229: U$8.PC4 46.95,11.64 | 47.75,12.45 51.05,12.45 52.58,10.92 52.58,7.87 53.09,7.37 JP8.4
  Top 0.254: 47.75,12.45 47.5,12.45 46.95,11.9 U$8.PC4
BIG_A5
  Top 0.229: U$8.PC5 46.45,11.9 | 51.44,12.95 JP8.3
  Top 0.254: 46.45,11.9 46.45,12.16 47.24,12.95 51.44,12.95
BIG_AREF  (via drill 0.38)
  Top 0.203: U$8.AREF 49.76,8.66 v49.78,8.64
  Bottom 0.203: v49.78,8.64 49.78,2.67 JP9.1
BIG_D2
  Top 0.229: U$8.PD2 44.45,11.69 42.67,13.46 JP6.2
BIG_D3
  Top 0.254: JP6.1 40.13,14.22 41.15,13.21 41.91,13.21 42.16,12.95 42.16,11.18 42.67,10.67 U$8.PD3
BIG_GND  (via drill 0.38)
  Top 0.254: U$8.GND3 47.77,9.16 v47.5,8.89 | U$8.GND2 44.73,8.66 v44.96,8.89 | U$8.GND 45.21,9.65 | 43.69,9.65 U$8.GND | U$8.GND
  other vias: 44.96,10.16 46.23,10.16 47.5,10.16 46.23,8.89 44.96,7.62 46.23,7.62 47.5,7.62 39.88,3.81 38.61,3.81 52.07,3.81 52.07,2.79 52.07,1.78 53.34,1.78 53.34,2.79 54.61,2.79 54.61,1.78 52.07,6.86 38.61,13.72
  pour Top: 38.1,16.51 55.63,16.51 55.63,1.02 38.1,1.02
  pour Bottom: 38.1,16.51 55.63,16.51 55.63,1.02 38.1,1.02
BIG_PB3_MISO
  Top 0.229: JP9.4 42.67,3.81 43.94,5.08 47.24,5.08 48.01,5.84 48.01,6.49 U$8.PB4
BIG_PB3_MOSI
  Top 0.229: U$8.PB3 47.45,6.05 46.99,5.59 43.56,5.59 JP9.5
BIG_PB3_SCK
  Top 0.229: U$8.PB5 48.63,5.7 47.5,4.57 45.72,4.57 45.21,4.06 JP9.3
BIG_RESET
  Top 0.229: U$8.PC6 45.95,12.42 47.75,14.22 R18.2 48.26,14.39 48.26,14.99 48.77,15.49 52.07,15.49 52.58,14.99 52.58,12.95 53.09,12.45 JP8.2
BIG_RX
  Top 0.229: U$8.PD0 45.45,12.94 46.99,14.48 46.99,15.24 47.75,16 53.47,16 JP8.1
BIG_TX
  Top 0.229: U$8.PD1 44.95,14.85
  Top 0.254: 44.95,14.85 JP6.3
BLE_3V3  (via drill 0.38)
  Top 0.254: C16.1 v66.84,37.82 NRF8001.1 | NRF8001.9 68.61,31.27 68.07,30.73 66.91,30.73 C22.2 | L6.2 63.17,38.94 62.99,39.12 62.99,39.88 62.48,40.39 62.48,40.64 | NRF8001.26 71.61,40.05 v71.11,40.55 71.11,42.26 C27.1 | v69.57,38.91 70.11,38.38 NRF8001.29 70.11,38.86 69.09,39.88 63.25,39.88 62.48,40.64 | NRF8001.24 72.86,40.09 v72.9,40.13 | C24.1 61.98,41.66 62.48,41.15 62.48,40.64
  Top 0.813: JP10.2 61.21,24.38 60.45,25.15 60.45,29.21 61.72,30.48 63.75,30.48 | 63.75,30.48 66.44,30.48 C22.2 | v63.75,31.75 63.75,30.48
  Bottom 0.254: v71.11,40.55 71.12,40.56 | v69.57,38.91 69.57,38.89 69.6,38.86
  Bottom 0.813: v72.9,40.13 71.53,40.13 71.12,40.54 | 71.12,40.54 v71.11,40.55 | 69.6,38.86 69.6,38.94 | 69.6,38.94 69.6,39.01 71.12,40.54 | 69.6,38.94 67.96,38.94 v66.84,37.82 64.75,37.82 63.5,36.58 63.5,32 v63.75,31.75
BLE_GND  (via drill 0.38)
  Top 0.254: NRF8001.17 72.11,33.3 v71.63,33.78 NRF8001.EP | NRF8001.EP 71.61,33.8 NRF8001.18 72.86,33.31 72.9,33.27 | NRF8001.23 71.61,36.3 NRF8001.EP | NRF8001.30 NRF8001.31 | NRF8001.30 69.61,35.8 NRF8001.EP | NRF8001.30 69.13,37.55 69.09,37.59 v69.09,36.32 NRF8001.EP | NRF8001.8 68.61,33.3 v69.09,33.78 NRF8001.EP
  other vias: 79.76,25.15 78.49,25.15 77.22,25.15 77.22,26.42 78.49,26.42 79.76,26.42 79.76,27.69 78.49,27.69 77.22,27.69 77.22,28.96 78.49,28.96 79.76,28.96 79.76,30.23 78.49,30.23 78.49,31.5 79.76,31.5 79.76,32.77 78.49,32.77 78.49,34.04 79.76,34.04 79.76,35.31 78.49,35.31 77.22,35.31 77.22,34.04 73.15,31.75 71.88,25.65 69.34,25.65 67.82,25.4 69.34,26.92 69.6,28.45 65.53,28.19 65.53,26.92 64.77,26.16 65.53,25.4 65.28,32 62.48,37.08 61.21,37.08 59.94,37.08 73.41,41.15 73.41,43.43 73.41,45.21 73.41,46.23 72.14,46.23 72.14,45.21 70.87,45.21 70.87,46.23 69.6,45.21 69.6,46.23 68.33,46.23 68.33,45.21 67.06,45.21 67.06,46.23 65.79,46.23 65.79,45.21 64.52,45.21 64.52,46.23 63.25,46.23 63.25,45.21 63.25,43.94 63.25,42.67 61.98,43.94 61.98,45.21 61.98,46.23 60.71,46.23 60.71,45.21 60.71,43.94 59.44,43.94 59.44,45.21 59.44,46.23 58.17,46.23 58.17,45.21 58.17,43.94 58.17,42.67 59.44,42.67 58.17,41.4 58.17,40.13 58.17,38.86 58.17,37.59 58.17,36.32 58.17,35.05 58.17,33.78 58.17,32.51 70.36,35.05 69.09,35.05 70.36,36.32 71.63,36.32 71.63,35.05 70.36,33.78 77.22,36.58 77.22,37.85 78.49,37.85 78.49,36.58 79.76,36.58 79.76,37.85
  pour Bottom (isolate 0.254): 80.52,21.84 80.52,38.61 75.69,38.61 75.69,46.74 57.4,46.74 57.4,21.84
  pour Top (isolate 0.254): 80.52,21.84 80.52,38.61 75.69,38.61 75.69,46.74 57.4,46.74 57.4,21.84
BLE_MISO
  Top 0.254: NRF8001.14 71.11,30.75 71.62,30.75 73.41,28.96 73.41,25.91 71.63,24.13 71.63,23.24 JP10.6
BLE_MOSI
  Top 0.254: R15.1 70.87,25.27 JP10.5
BLE_MOSI_SHIFTED
  Top 0.254: NRF8001.13 70.61,28.34 R15.2 R17.2
BLE_RDNY
  Top 0.254: NRF8001.16 72.14,32.52 72.14,31.24 74.17,29.21 74.17,23.5 JP10.7
BLE_REQN
  Top 0.254: R14.1 66.8,23.5 JP10.4
BLE_REQN_SHIFTED
  Top 0.254: NRF8001.12 70.11,30.12 R16.2 R14.2
BLE_RESET
  Top 0.203: NRF8001.19 73.39,34.3 73.66,34.04 73.66,33.78
  Top 0.254: JP10.8 76.2,23.24 76.2,28.7 75.44,29.46 74.68,29.46 74.17,29.97 74.17,33.27 73.66,33.78
BLE_SCK
  Top 0.254: R12.1 62.23,25.65 63.75,24.13 JP10.3
BLE_SCK_SHIFTED
  Top 0.254: R12.2 R13.2 64.15,28.08 65.53,29.46 68.33,29.46 69.6,30.73 69.6,32.54 NRF8001.11
D0/RX
  Top 0.254: U1.20 37.31,28.22 42.16,23.37 47.24,23.37 49.02,21.59 49.02,20.19 JP11.4
D1/TX
  Top 0.254: U1.21 37.81,28.73 42.67,23.88 50.55,23.88 51.82,22.61 JP11.5
D2/SDA
  Top 0.254: U1.19 36.81,27.7 41.66,22.86 44.7,22.86 46.74,20.83 JP11.3
D3/SCL
  Top 0.254: U1.18 36.31,26.93 40.89,22.35 42.93,22.35 44.2,21.08 JP11.2
D4*
  Top 0.254: U1.25 50.52,31.77 50.8,31.5 50.8,25.15 52.07,23.88 54.23,23.88 JP12.9
D5*
  Top 0.254: U1.31 46.71,34.77 51.31,39.37 JP12.3
D6*
  Top 0.254: U1.27 51.55,32.77 52.32,32 52.32,30.23 53.34,29.21 JP12.7
D7  (via drill 0.38)
  Top 0.254: U1.1 32.04,35.77 v31.5,36.32
  Bottom 0.254: v31.5,36.32 31.5,41.91 32.51,42.93 51.05,42.93 52.58,44.45 JP12.1
D+
  Top 0.305: X1.D+ 7.28,31.24
  Top 0.406: 7.28,31.24 R10.2 8.04,28.6 Z1.1
D-
  Top 0.305: X1.D- 7.17,31.89 7.18,31.9
  Top 0.406: Z2.1 7.89,33.93 R3.2 7.18,31.9
GND  (via drill 0.38)
  Top 0.254: 34.54,34.54 v33.91,35.18 33.81,35.27 U1.43 33.81,37.81 33.27,38.35 v32.64,38.35 30.73,38.35 26.92,42.16 C7.2 | 34.54,34.54 v35.18,33.91 U1.EXP | U1.35 37.81,35.27 v37.72,35.18 v36.45,33.91 U1.EXP | 34.54,34.54 v33.91,33.91 33.77,33.77 U1.5 32.53,33.78 25.4,33.78 24.8,33.19 C5.2 | U1.23 38.31,30.77 v37.72,31.37 v36.45,32.64 U1.EXP | U1.EXP 35.81,31.75 34.8,30.73 34.8,30.02 U1.15 | C13.1 35.77,19.72 Y3.2 35.28,20.07 35.05,20.07 33.62,21.5 Y3.4 33.32,21.42 C12.1 | C10.2 C11.2 25.14,23.11 RESET.4 RESET.2
  other vias: 16.76,19.3 18.03,19.3 19.3,19.3 20.57,19.3 20.57,20.57 19.3,20.57 18.03,20.57 16.76,20.57 16.76,21.84 18.03,21.84 19.3,21.84 20.57,21.84 20.57,23.11 19.3,23.11 18.03,23.11 18.03,24.38 16.76,23.11 16.76,24.38 16.76,25.65 16.76,26.92 16.18,36.42 16.18,37.72 16.15,39.01 16.15,40.26 16.15,41.53 16.13,42.8 16.13,45.36 17.22,46.1 33.5,41.88 21.92,35.92 21.92,32.87 22.5,30.02 24.16,30.02 39.62,40.26 45.49,36.02 46.63,37.13 49.23,39.32 50.29,40.41 49.12,41.76 49.15,44.07 47.24,44.07 47.24,45.97 49.15,45.97 51.05,45.97 52.96,45.97 50.6,41.76 52.07,40.56 52.02,38.05 49.78,35.18 51.05,35.18 52.32,35.18 36.91,24.71 36.98,23.09 38.43,23.09 47.7,21.69 49.94,22.5 53.59,21.84 54.86,21.84 54.86,20.57 54.86,19.3 33.91,31.37 35.18,31.37 36.45,31.37 37.72,32.64 35.18,32.64 33.91,32.64 37.72,33.91 36.45,35.18 35.18,35.18
  pour Bottom (isolate 0.254): 15.49,46.74 55.88,46.74 55.88,18.54 15.49,18.54
  pour Top (isolate 0.254): 15.49,46.74 55.88,46.74 55.88,18.54 15.49,18.54
HWB
  Top 0.254: U1.33 39.58,35.77 39.58,36.62 R4.1
IO8
  Top 0.254: U1.28 52.7,33.27 JP12.6
IO9*
  Top 0.254: U1.29 42.41,33.77 | 42.41,33.77 42.42,33.78 | 42.41,33.77 53.97,33.77 JP12.5
IO10*
  Top 0.254: U1.30 46.97,34.27 49.53,36.83 JP12.4
IO11*  (via drill 0.38)
  Top 0.254: U1.12 33.31,28.49 32.77,27.94 32.77,25.91 31.75,24.89 v31.75,24.13
  Bottom 0.254: JP11.1 41.27,20.57 34.54,20.57 31.75,23.37 v31.75,24.13
IO12*
  Top 0.254: U1.26 51.04,32.27 51.56,31.75 51.56,27.94 52.83,26.67 JP12.8
IO13*
  Top 0.254: U1.32 40.16,35.27 SJ2.1 41.71,37.65 42.16,38.1 43.43,38.1 43.69,38.35 43.69,41.91 44.7,42.93 53.21,42.93 JP12.2
MISO  (via drill 0.38)
  Top 0.254: U1.11 31.03,30.77 27.43,27.18 19.05,27.18 17.27,28.96 v17.27,29.21 | J4.1 17.78,44.7 17.27,44.2 v17.27,43.18
  Bottom 0.254: v17.27,43.18 v17.27,29.21
MOSI  (via drill 0.38)
  Top 0.254: U1.10 30.51,31.27 27.18,27.94 20.57,27.94 18.8,29.72 18.8,30.73 19.56,31.5 v22.86,31.5
  Bottom 0.254: J4.4 23.11,42.16 23.62,41.66 23.62,32.26 v22.86,31.5
N$1  (via drill 0.38)
  Top 0.254: v39.88,29.72 42.97,29.72 R7.1 | v31.75,28.7 31.75,27.18 30.73,26.16 29.91,26.16 SJ1.2
  Bottom 0.254: v39.88,29.72 38.86,28.7 v31.75,28.7
N$2
  Top 0.254: R7.2 RX.A
N$3
  Top 0.254: R5.2 ON.A
N$4
  Top 0.254: R6.2 TX.A
N$5
  Top 0.254: SJ2.2 44.2,36.83 45.21,37.85 45.21,39.26 R8.1
N$6
  Top 0.254: SJ3.2 42.84,28.19 R6.1
N$7
  Top 0.254: R8.2 47.17,40.98 L.A
N$8
  Top 0.406: R3.1 SJ5.2
N$9
  Top 0.406: R10.1 SJ4.2
N$10
  Top 0.203: 42.16,8.64 40.13,8.64 39.62,9.14 39.62,9.37 Y1.1
  Top 0.254: C8.2 39.28,9.86 Y1.1 | U$8.PB6 43.14,7.66 42.16,8.64
N$12
  Top 0.229: U$8.PB7 41.38,7.16
  Top 0.254: C15.2 41.06,5.41 Y1.3 41.38,7.16
N$13
  Top 0.254: NRF8001.2 65.44,36.3 C18.1
N$15
  Top 0.254: NRF8001.32 68.61,38.29 L5.1
N$16
  Top 0.254: SJ11.2 66.27,16.47 C30.1 69.49,17.11 Y2.3
N$17
  Top 0.254: L5.2 L6.1
N$18
  Top 0.254: NRF8001.3 65.66,35.8 C17.1
N$19
  Top 0.254: NRF8001.4 66.8,35.3 65.79,34.29 62.16,34.29 61.81,34.63 32.768KHZ.P$1
  Top 0.406: C20.1 61.86,34.58 61.81,34.63
N$20
  Top 0.254: NRF8001.5 67.06,34.8 66.04,33.78 63.5,33.78 62.48,32.77 59.44,32.77 59.18,33.02 59.18,38.35 59.69,38.86 61.14,38.86 32.768KHZ.P$2 61.86,39.58 C21.1
N$23
  Top 0.203: NRF8001.20 73.61,34.8 74.04,34.37 75.48,34.37 L1.2
  Top 0.254: 75.58,34.04 L1.2
  Top 0.406: L1.2 75.69,33.02 | 75.69,33.02 75.25,33.02 C23.2 | 75.69,33.02 76.14,33.02 N/A.2
N$24
  Top 0.203: NRF8001.22 74.47,35.8 L3.2
  Top 0.254: 74.61,36.4 L3.2
  Top 0.61: L4.1 L3.2
N$25
  Top 0.203: NRF8001.21 74.49,35.3 L3.1
  Top 0.254: 74.54,35.3 L3.1
  Top 0.406: 74.71,35.19 L3.1 74.8,34.99 L1.1
N$26
  Top 0.61: C25.2 L4.2
N$27  (1 unrouted)
  Top 0.61: C26.1 C25.1
  Top 1.016: 74.99,40.39 78.26,40.39 U$10.FEED
N$28
  Top 0.254: NRF8001.25 72.11,41.99 R11.1
N$29
  Top 0.254: NRF8001.28 70.61,39.11 70.61,39.12 69.34,40.39 64.77,40.39 64.01,41.15 64.01,43.18 64.26,43.43 64.71,43.43 C28.1 65.25,43.85 Y4.4
N$30
  Top 0.254: NRF8001.27 71.11,39.38 69.62,40.87 69.62,42 | Y4.2 69.62,42 | 69.62,42 C29.1
N$34
  Top 0.254: SJ10.1 68.81,15.04 69.57,15.8 72.87,15.8 73.13,16.05 73.13,18.59 | 73.13,18.59 72.87,18.85 71.9,18.85 Y2.1 | C31.1 73.34,18.81 73.13,18.59
PWR_3V3  (via drill 0.38)
  Top 0.406: C4.1 5.19,7.74 v5.36,7.57 | U4.5 8.6,6.62 v8.91,6.04
  Bottom 0.813: v5.36,7.57 6.63,6.3 8.66,6.3 v8.91,6.04
  Bottom 1.016: JP1.1 2.56,22.3 1.8,21.54 1.8,8.84 3.07,7.57 v5.36,7.57
PWR_5V
  Top 0.406: 8.15,15.19 U2.4 8.91,15.39 8.91,20.18 C2.1 | 8.15,15.19 U2.2 | U4.3 6.7,8.77 6.88,8.59 7.64,8.59 | 8.66,9.82 8.66,8.84 8.41,8.59 7.64,8.59 | 8.66,9.82 U4.1 | 8.66,9.82 8.66,14.68 8.15,15.19 | C2.1 6.18,20.69 C3.A | JP1.2 9.84,19.76 8.91,20.69 C2.1 | 7.64,8.59 7.64,6.02 T2.3 9.14,5.03 10.69,5.03 12.39,6.73 T1.2
PWR_GND  (via drill 0.38)
  other vias: 10.69,20.9 10.69,18.36 10.95,15.95 7.65,18.75 5.61,18.75 3.58,18.75 4.6,13.92 6.63,13.92 6.63,12.14 4.6,12.14 3.33,11.13 5.36,10.62 13.74,9.86 13.74,8.33 13.74,6.81 13.74,5.28 13.74,3.76 13.74,2.24 12.22,3.76 12.22,2.24 10.69,2.24 1.55,1.73 1.55,23.57
  pour Bottom (isolate 0.254): 14.5,24.08 0.03,24.08 0.03,1.22 14.5,1.22
  pour Top (isolate 0.254): 14.5,24.08 0.03,24.08 0.03,1.22 14.5,1.22
PWR_VIN  (via drill 0.38)
  Top 0.254: R9.2 5.53,4.61 5.87,4.27 5.87,3.76 6.88,2.74 T2.1
  Top 0.406: 7.84,2.65 T2.1 9.42,2.74 v10.44,3.76 | v10.44,6.3 10.46,6.33 T1.3 10.46,12.55 JP1.4
  Bottom 0.406: v10.44,6.3 v10.44,3.76
PWR_VUSB
  Top 0.406: T1.1 11.43,10.72 JP1.5
RD_N
  Top 0.254: U1.3 17.69,34.77 14.89,31.98 13.18,31.98 SJ5.1
RD_P
  Top 0.254: U1.4 17.83,34.27 15.08,31.52 13.23,31.52 12.7,30.99 12.7,30.79 SJ4.1
RESET  (via drill 0.38)
  Top 0.254: U1.13 33.81,27.97 33.27,27.43 v33.27,24.64 | D2.A 26.67,25.65 27.18,25.15 27.18,23.63 RESET.3 | RESET.1 RESET.3 | R1.2 20.32,37.08 19.3,38.1 J4.5 | v28.45,23.62 27.25,23.62 RESET.3
  Bottom 0.254: J4.5 19.3,38.35 18.29,37.34 18.29,26.67 20.32,24.64 29.46,24.64 | v33.27,24.64 32.77,25.15 30.23,25.15 29.72,24.64 29.46,24.64 | 29.46,24.64 v28.45,23.62
RXLED/SS  (via drill 0.38)
  Top 0.254: U1.8 29.48,32.27 28.19,30.99 v27.69,30.99 | SJ1.1 28.89,27.11 v30.48,28.7
  Bottom 0.254: v30.48,28.7 30.48,29.21 28.7,30.99 v27.69,30.99
SCK  (via drill 0.38)
  Top 0.254: U1.9 30,31.77 26.92,28.7 21.59,28.7 v20.57,29.72 20.83,29.46 | J4.3 17.78,42.16 17.27,41.66 17.27,37.85 18.54,36.58 v19.3,36.58
  Bottom 0.254: v20.57,29.72 20.32,30.23 20.32,35.56 v19.3,36.58
TINY_5V  (via drill 0.38)
  Top 0.254: TINY.VCC 68.75,12.1 69.34,12.7 70.36,12.7 | 70.36,12.7 71.12,13.46 71.12,14.13 C32.2 | JP5.1 59.18,18.03 60.2,19.05 64.12,19.05 R19.2 63.59,18.03 v62.74,18.03 | 70.36,12.7 71.12,12.7 v71.37,12.45
  Bottom 0.254: v71.37,12.45 69.34,12.45 68.07,13.72 67.31,13.72 66.55,14.48 66.55,18.03 65.79,18.8 63.5,18.8 v62.74,18.03
TINY_GND  (via drill 0.38)
  other vias: 70.1,8.76 68.33,8.79 69.22,9.65 70.1,10.67 68.33,10.67
  pour Bottom: 80.26,1.02 80.52,20.07 57.66,20.07 57.66,1.02
  pour Top: 80.26,1.02 80.52,20.07 57.66,20.07 57.66,1.02
TINY_PA0
  Top 0.254: TINY.PA0 73.98,10.73 76.96,13.72 76.96,16.26 77.98,17.27 JP3.1
TINY_PA1
  Top 0.254: TINY.PA1 74.49,10.23 78.74,14.48 78.99,14.48 JP3.2
TINY_PA2
  Top 0.254: TINY.PA2 75.01,9.73 77.47,12.19 JP3.3
TINY_PA3
  Top 0.254: TINY.PA3 78.83,9.23 JP3.4
TINY_PA4
  Top 0.254: TINY.PA4 77.88,8.73 JP3.5
TINY_PA5
  Top 0.254: TINY.PA5 76.08,7.74 JP3.6
TINY_PA6
  Top 0.254: TINY.PA6 68.25,7.19 68.83,6.6 73.41,6.6 77.98,2.03 JP3.7
TINY_PA7
  Top 0.254: TINY.PA7 64.61,8.73 60.45,4.57 JP5.6
TINY_PB0  (via drill 0.38)
  Top 0.254: 68.75,13.64 SJ10.2 67.25,12.14 | TINY.PB0 67.25,12.14 | 67.25,12.14 67.25,12.39 v67.31,12.45 | v63.25,15.75 60.96,15.75 59.94,14.73 JP5.2
  Bottom 0.254: v67.31,12.45 66.29,12.45 65.53,13.21 65.53,15.49 65.02,16 63.5,16 v63.25,15.75
TINY_PB1
  Top 0.254: TINY.PB1 66.73,10.23 66.29,10.67 66.29,13.67 SJ11.1 62.97,13.7 61.47,12.19 JP5.3
TINY_PB2
  Top 0.254: TINY.PB2 59.35,9.23 JP5.4
TINY_PB3  (via drill 0.38)
  Top 0.254: TINY.PB3 66.47,9.73 64.52,11.68 | 64.52,11.68 v64.52,12.45 | v64.52,14.99 64.52,16.95 R19.1 | JP5.5 60.96,7.11 v61.98,8.13 | v61.98,10.16 61.98,10.67 62.99,11.68 64.52,11.68
  Bottom 0.254: v64.52,12.45 v64.52,14.99 | v61.98,8.13 v61.98,10.16
TXLED
  Top 0.254: U1.22 38.31,29.25 39.37,28.19 SJ3.1
UCAP
  Top 0.254: U1.6 27.27,33.27 C5.1
USB_GND  (via drill 0.38)
  Top 0.406: R2.1 C9.2 | Z2.2 11.18,36.07 11.43,36.32 11.43,38.63 C14.A
  other vias: 7.11,26.67 10.16,26.67 13.21,26.67 11.68,28.19 6.1,29.72 5.59,27.94 6.35,40.13 3.3,45.72 10.41,42.67 12.19,36.07 1.52,31.24
  pour Top (isolate 0.254): 0,24.89 13.97,24.89 13.97,46.74 0,46.74
  pour Top (isolate 0.254): 1.27,26.16 1.27,37.59 5.08,37.59 5.08,26.16
  pour Bottom: 0,24.89 13.97,24.89 13.97,46.74 0,46.74
USB_VUSB
  Top 0.406: R2.2 C9.1 | F1.2 12.36,44.79 11.43,45.72 5.84,45.72 5,44.88 JP2.2
  Top 0.61: R2.2 4.57,42.75 JP2.2
VUSB  (via drill 0.38)
  Top 0.254: U1.7 28.46,32.77 v27.94,32.26
  Bottom 0.254: v27.94,32.26 27.94,35.56 28.19,35.81
  Bottom 0.813: JP7.1 29.46,37.08 28.19,35.81
VUSBD
  Top 0.254: 5.13,32.56 4.2,32.56 X1.VBUS
  Top 0.406: 5.13,32.56 6.35,33.78 6.35,37.59 7.62,38.86 C14.C 8.66,38.86 8.66,42.22 F1.1 8.91,42.22
XTAL1
  Top 0.254: U1.17 35.81,21.62 Y3.3 35.77,21.42 C13.2
XTAL2
  Top 0.254: U1.16 35.31,24.14 34.29,23.11 29.72,23.11 28.96,22.35 28.96,20.57 29.81,19.72 C12.2 33.32,19.72 Y3.1

### Text on the board
tPlace: BLEduino | Big Board
tNames: MISO | Vusb | 5V | D7 | VUSB | SCK | A5 | A4 | A3 | A2 | A1 | A0 | GND | 13 | MOSI | 5 | RST | GND | 10 | 9 | RD- | 8 | RD+ | 6 | 12 | ACTIVE | 3V | SCK | RQN | MOSI | MISO | RDN | RST | GND | 4 | 3V | 11 | 3 | 2 | 0 | 1 | 5V | GND | PA0 | 5V | Vin | RX | PA1 | 3 | 2 | TX | PB0 | Vusb | RST | PA2 | PB1 | A5 | PA3 | PB2 | A4 | PA4 | PB3 | GND | SCK | 5V | PA5 | MISO | PA7 | PA6 | GND
bNames: MOSI